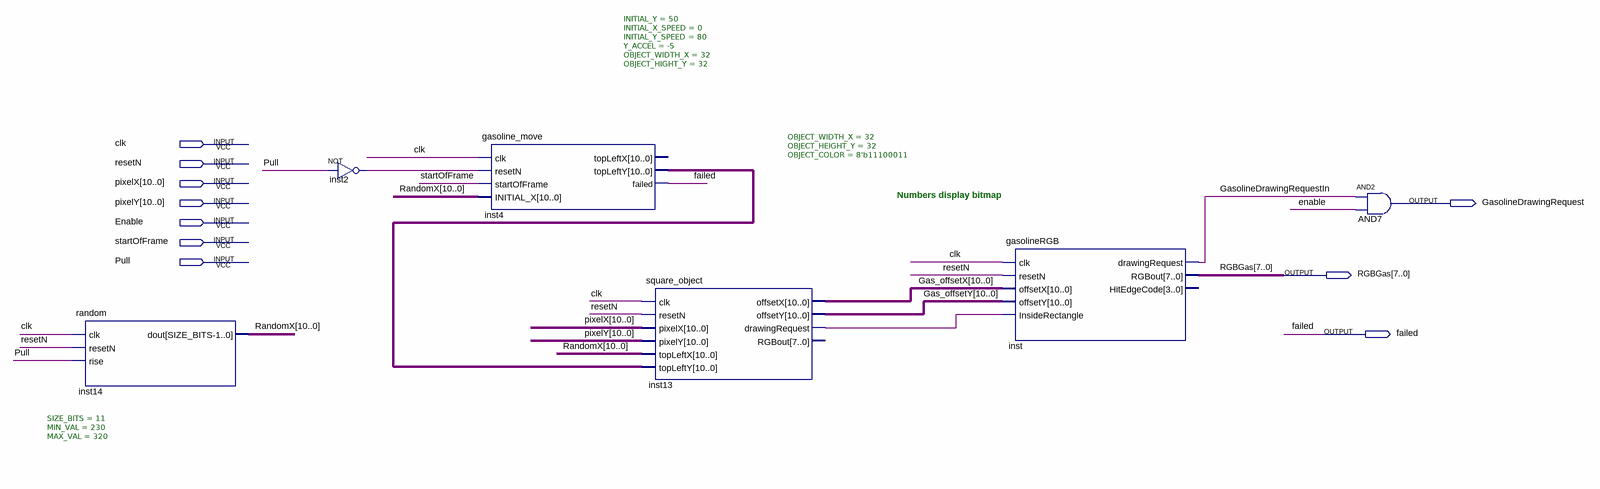
[diagram p0: schematic sheet]
// Quartus schematic gasolineDisplay.bdf as structural Verilog: 6 symbols, 10 pins
module gasolineDisplay (
  input  clk,
  input  resetN,
  input  [10:0] pixelX,
  input  [10:0] pixelY,
  input  Enable,
  input  startOfFrame,
  input  Pull,
  output GasolineDrawingRequest,
  output [7:0] RGBGas,
  output failed
);

  wire GasolineDrawingRequestIn, inst2_out, inst13_drawingrequest;
  wire [10:0] Gas_offsetX, Gas_offsetY, inst4_toplefty, RandomX;

  random #(.SIZE_BITS(11), .MIN_VAL(230), .MAX_VAL(320)) inst14 (
    .clk(clk), .resetN(resetN), .rise(Pull), .dout(RandomX));
  not inst2 (inst2_out, Pull);
  gasoline_move #(.INITIAL_Y(50), .INITIAL_X_SPEED(0), .INITIAL_Y_SPEED(80), .Y_ACCEL(-5), .OBJECT_WIDTH_X(32), .OBJECT_HIGHT_Y(32)) inst4 (
    .clk(clk), .resetN(inst2_out), .startOfFrame(startOfFrame), .INITIAL_X(RandomX),
    .topLeftY(inst4_toplefty), .failed(failed));  // open: topLeftX
  square_object #(.OBJECT_WIDTH_X(32), .OBJECT_HEIGHT_Y(32), .OBJECT_COLOR(8'b11100011)) inst13 (
    .clk(clk), .resetN(resetN), .pixelX(pixelX), .pixelY(pixelY), .topLeftX(RandomX),
    .topLeftY(inst4_toplefty), .offsetX(Gas_offsetX), .offsetY(Gas_offsetY),
    .drawingRequest(inst13_drawingrequest));  // open: RGBout
  gasolineRGB inst (
    .clk(clk), .resetN(resetN), .offsetX(Gas_offsetX), .offsetY(Gas_offsetY),
    .InsideRectangle(inst13_drawingrequest), .drawingRequest(GasolineDrawingRequestIn), .RGBout(RGBGas));  // open: HitEdgeCode
  and AND7 (GasolineDrawingRequest, GasolineDrawingRequestIn, Enable);

  // Notes on the sheet:
  //   Numbers display bitmap
endmodule
